# Altium schematic sheet 2_POWER.SchDoc: PLC P1
size 420 x 297 mm; CompanyName: Pytenax; DrawnBy: Otavio Luz; DocumentNumber: 2; Revision: 2; SheetNumber: 2; SheetTotal: 5
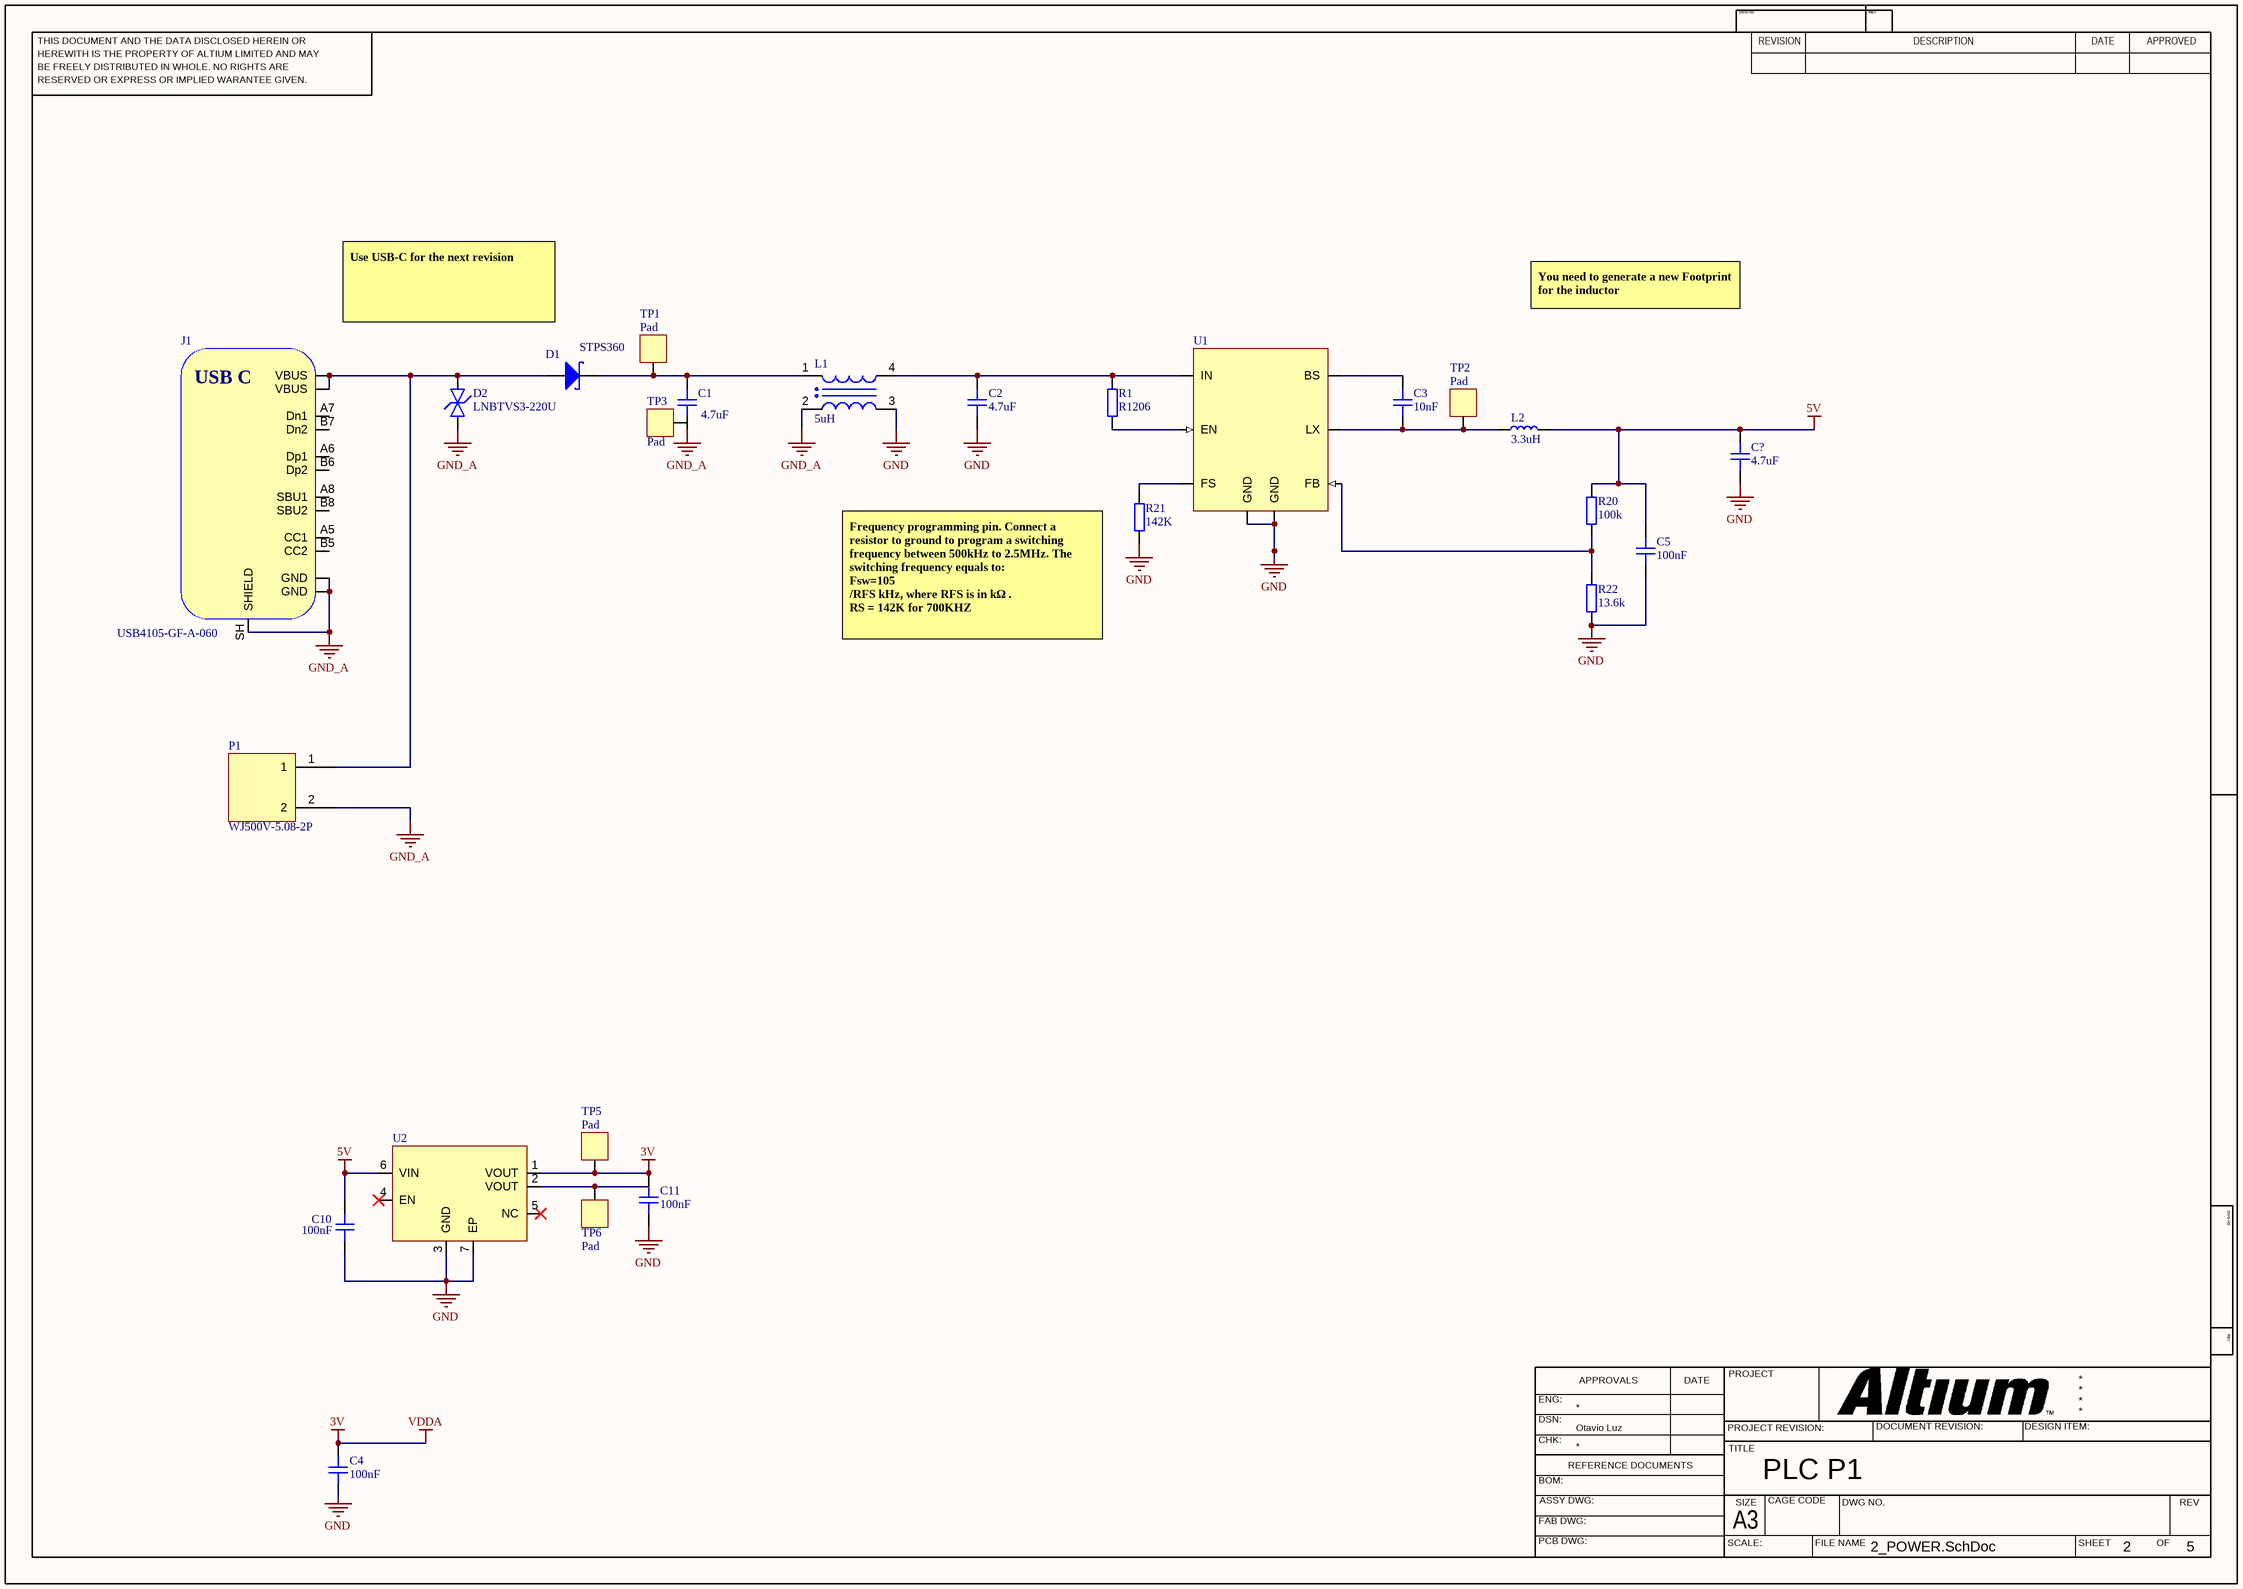
[diagram p0: 2_POWER.SchDoc]

## Parts
C1  4.7uF  [CAP_0603]
C2  4.7uF  [CAP_0603]
C3  10nF  [CAP_0603]
C4  100nF  [CAP_0603]
C5  100nF  [CAP_0603]
C10  100nF  [CAP_0603]
C11  100nF  [CAP_0603]
C?  4.7uF  [CAP_0603]
D1  value STPS360  [SOD-128]  (hidden comment: STPS360-Y)
D2  LNBTVS3-220U  [SMC-DO-214AB]
J1  USB4105-GF-A-060  [USB4105-GF-A-060]
L1  value 5uH  [WE-SL5 HC]
L2  3.3uH  [ASPI-0630HI-6R8M-T15]
P1  WJ500V-5.08-2P  [WJ500V-5.08-2P]
R1  R1206  [RES_1206]
R20  100k  [RES_0603]
R21  142K  [RES_0603]
R22  13.6k  [RES_0603]
TP1  Pad  [PAD_SQ_2MM]  (no BOM)
TP2  Pad  [PAD_SQ_2MM]  (no BOM)
TP3  Pad  [PAD_SQ_2MM]  (no BOM)
TP5  Pad  [PAD_SQ_2MM]  (no BOM)
TP6  Pad  [PAD_SQ_2MM]  (no BOM)
U1  SY8303AIC  [TSOT23-8]  (value not drawn)
U2  MIC5528-3.3YMT-TR  [TDFN-6]  (value not drawn)

## Nets
3V: C4.2 C11.2 TP5.1 U2.1(VOUT)  [also labelled VDDA]
5V: C5.2 C10.2 C?.2 L2.2 R20.2 U2.6(VIN)
GND: C2.1 C4.1 C5.1 C10.1 C11.1 C?.1 L1.3 R21.1 R22.1 U1.3(GND) U1.4(GND) U2.3(GND) U2.7(EP)
GND_A: C1.1 D2.A J1.A1B12(GND) J1.B1A12(GND) J1.SH(SHIELD) L1.2 P1.2
NetC1_2: C1.2 D1.1(K) L1.1 TP1.1
NetC2_2: C2.2 L1.4 R1.2 U1.5(IN)
NetC3_1: C3.1 L2.1 TP2.1 U1.6(LX)
NetC3_2: C3.2 U1.7(BS)
NetD1_2: D1.2(A) D2.K J1.A4B9(VBUS) J1.B4A9(VBUS) P1.1
NetR1_1: R1.1 U1.8(EN)
NetR20_1: R20.1 R22.2 U1.1(FB)
NetR21_2: R21.2 U1.2(FS)
NetTP6_1: TP6.1 U2.2(VOUT)

Not connected (* = marked no-connect by the designer): J1 A5(CC1) A6(Dp1) A7(Dn1) A8(SBU1) B5(CC2) B6(Dp2) B7(Dn2) B8(SBU2); TP3 1; U2 4(EN)* 5(NC)*

## Notes on the sheet
- Use USB-C for the next revision
- You need to generate a new Footprint for the inductor
- (near R21) Frequency programming pin. Connect a resistor to ground to program a switching
  frequency between 500kHz to 2.5MHz. The switching frequency equals to:
  Fsw=105
  /RFS kHz, where RFS is in kΩ .
  RS = 142K for 700KHZ
- THIS DOCUMENT AND THE DATA DISCLOSED HEREIN OR
- HEREWITH IS THE PROPERTY OF ALTIUM LIMITED AND MAY
- DWG NO:
- REVISION
- REV:
- DESCRIPTION
- DATE
- APPROVED
- BE FREELY DISTRIBUTED IN WHOLE. NO RIGHTS ARE
- RESERVED OR EXPRESS OR IMPLIED WARANTEE GIVEN.
- ENG:
- APPROVALS
- PROJECT
- DSN:
- CHK:
- REFERENCE DOCUMENTS
- PROJECT REVISION:
- TITLE
- DOCUMENT REVISION:
- DESIGN ITEM:
- BOM:
- FAB DWG:
- PCB DWG:
- ASSY DWG:
- SCALE:
- A3
- SIZE
- CAGE CODE
- FILE NAME
- DWG NO.
- SHEET
- OF
- REV
- (in symbol USB4105-GF-A-060) USB C

## Library data of the parts
C1-C3 C5 C? = CAP_0603_25V: Capacitor SMD 0603 25V
C4 C10 C11 = CAP_0603_16V: Capacitor SMD 0603 16V
D1 = CMP-01-D000008-4: Schottky 60V 3A Vf=0.610V SOD-128 -40°C +175°C; Internal Part Number: 01D008; Manufacturer Part Number: STPS360AFY; Manufacturer: STMicroelectronics; Max Temperature: 175°C; Voltage - Forward: 610mV; Current - Reverse Leakage: 150µA @ 60V; Mounting Technology: Surface Mount; RoHS Compliant: YES; Voltage - DC Reverse: 60V; Current - Average Rectified: 3A; Pins: 2; Package/Case: SOD-128; Min Temperature: -40°C; Ratings: AEC-Q101
D2 = D_TVS_BI_SMC: Diode TVS / ESD Bidirectional SMC (DO-214AB); Manufacturer: *; Manufacturer Part Number: *; Distributor Link: *
J1 = USB4105-GF-A-060: USB Connector Type C SMT 12 Pin; Manufacturer: GCT; Manufacturer Part Number: USB4105-GF-A-060
L1 = CMP-01-CMC000005-2: 5uH 5A 5.5mΩ 80V -40°C +125°C; Manufacturer: Wurth Elektronik; Internal Part Number: 01L003; Manufacturer Part Number: 744273501; Impedance @ Frequency: 500 Ohms @ 130MHz; Shielding: Unshielded; Max Temperature: 125°C; Voltage Rating: 80V; Min Temperature: -40°C; Current Rating (Max): 5A; DC Resistance (DCR) (Max): 5.5mΩ; Pins: 4; Package/Case: WE-SL5 HC; Mounting Technology: SMT; RoHS Compliant: YES; Size / Dimension: 9.50mm x 8.30mm; Inductor Type: Common Mode Choke; Height (Max): 5.3mm
L2 = ASPI-0630HI-6R8M-T15: 6.5A 3.3uH ±20% 23mΩ SMD,6.6x7.2mm Inductors (SMD) ROHS; Manufacturer: SHOU HAN; Manufacturer Part Number: CYA0630-3.3UH
P1 = WJ500V-5.08-2P: 1x2P 18A -40℃~+105℃ 250V Green 14~30 Straight 5.08mm 2.5 1 2 Plugin,P=5.08mm Screw terminal ROHS
R1 = RES_1206: Resistor SMD 1206; Manufacturer: *; Manufacturer Part Number: *; Distributor Link: *
R20-R22 = RES_0603: Resistor SMD 0603; Manufacturer: *; Manufacturer Part Number: *; Distributor Link: *
TP1-TP3 TP5 TP6 = PAD_SQ_2MM: Test Point Square 2mm
U1 = SY8303AIC: High Efficiency Fast Response, 3A, 40V Input Synchronous Step Down Regulator; Manufacturer: Silergy; Manufacturer Part Number: SY8303AIC; Distributor Link: https://www.lcsc.com/product-detail/DC-DC-Converters_Silergy-Corp-SY8303AIC_C97054.html; LCSC: C97054
U2 = MIC5528-3.3YMT-TR: LDO Regulator 3V3 500mA 2.5V<Vin<5.5V; Manufacturer: Microchip; Manufacturer Part Number: MIC5528-3.3YMT-TR